# Altium schematic sheet SD Card.SchDoc
size A4; SheetNumber: 3; SheetTotal: 7
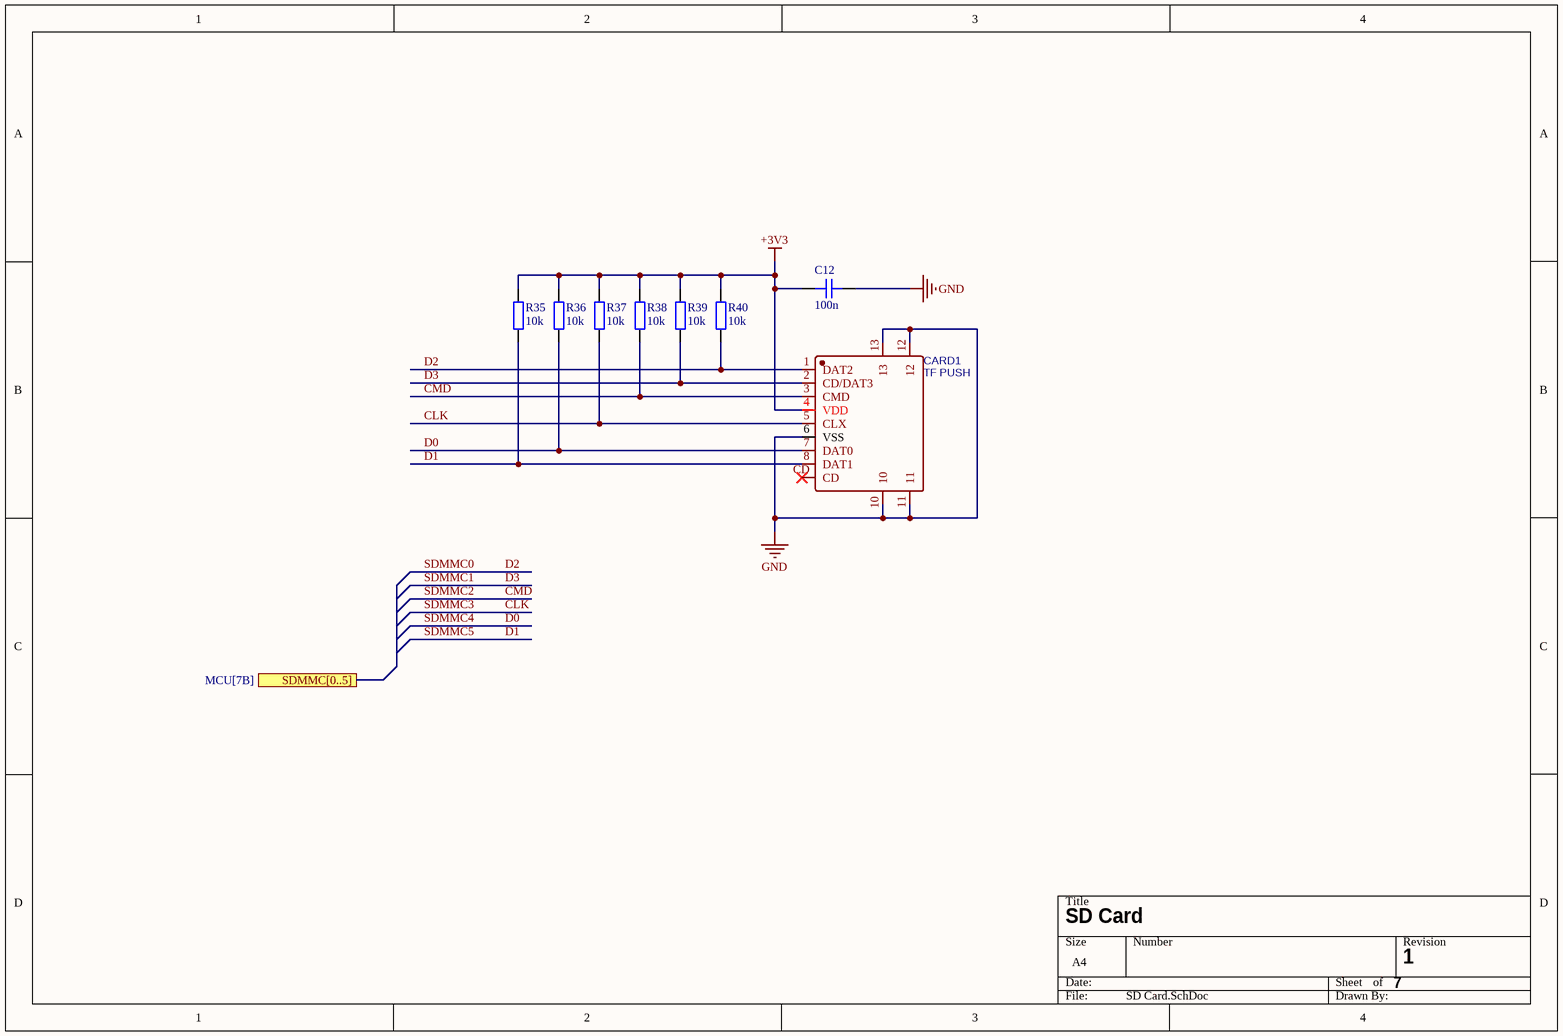
[diagram p0: SD Card.SchDoc]

## Parts
C12  Rating: 100n  [CAP_0402]  (hidden comment: CL05B104KB54PNC)
CARD1  TF PUSH  [TF-SMD_TF-PUSH]
R35  value 10k  [RES_0402]  (hidden comment: 0402WGF1002TCE)
R36  value 10k  [RES_0402]  (hidden comment: 0402WGF1002TCE)
R37  value 10k  [RES_0402]  (hidden comment: 0402WGF1002TCE)
R38  value 10k  [RES_0402]  (hidden comment: 0402WGF1002TCE)
R39  value 10k  [RES_0402]  (hidden comment: 0402WGF1002TCE)
R40  value 10k  [RES_0402]  (hidden comment: 0402WGF1002TCE)

## Ports
SDMMC[0..5] (see MCU[7B])

## Nets
+3V3: C12.2 CARD1.4(VDD) R35.2 R36.2 R37.2 R38.2 R39.2 R40.2
GND: C12.1 CARD1.6(VSS) CARD1.10 CARD1.11 CARD1.12 CARD1.13
CLK: CARD1.5(CLX) R37.1  [also labelled SDMMC3]
CMD: CARD1.3(CMD) R38.1  [also labelled SDMMC2]
D0: CARD1.7(DAT0) R36.1  [also labelled SDMMC4]
D1: CARD1.8(DAT1) R35.1  [also labelled SDMMC5]
D2: CARD1.1(DAT2) R40.1  [also labelled SDMMC0]
D3: CARD1.2(CD/DAT3) R39.1  [also labelled SDMMC1]

Not connected (* = marked no-connect by the designer): CARD1 CD*

## Notes on the sheet
- SD Card
- 7
- 1

## Library data of the parts
C12 = CAP_0402: Capacitor SMD 0402; Manufacturer: *; Manufacturer Part Number: *; Distributor Link: *; LCSC: *; Dielectric: *
CARD1 = TF PUSH: Manufacturer: SHOU HAN(首韩); Contributor: LCSC; Supplier: LCSC; Supplier Part: C393941; Manufacturer Part: TF PUSH; JLCPCB Part Class: Extended Part; spicePre: C; spiceSymbolName: TF PUSH
R35-R40 = RES_0402: Resistor SMD 0402; Manufacturer: *; Manufacturer Part Number: *; Distributor Link: *; LCSC: *